# Altium schematic sheet MCUSheet.SchDoc
size 279 x 254 mm
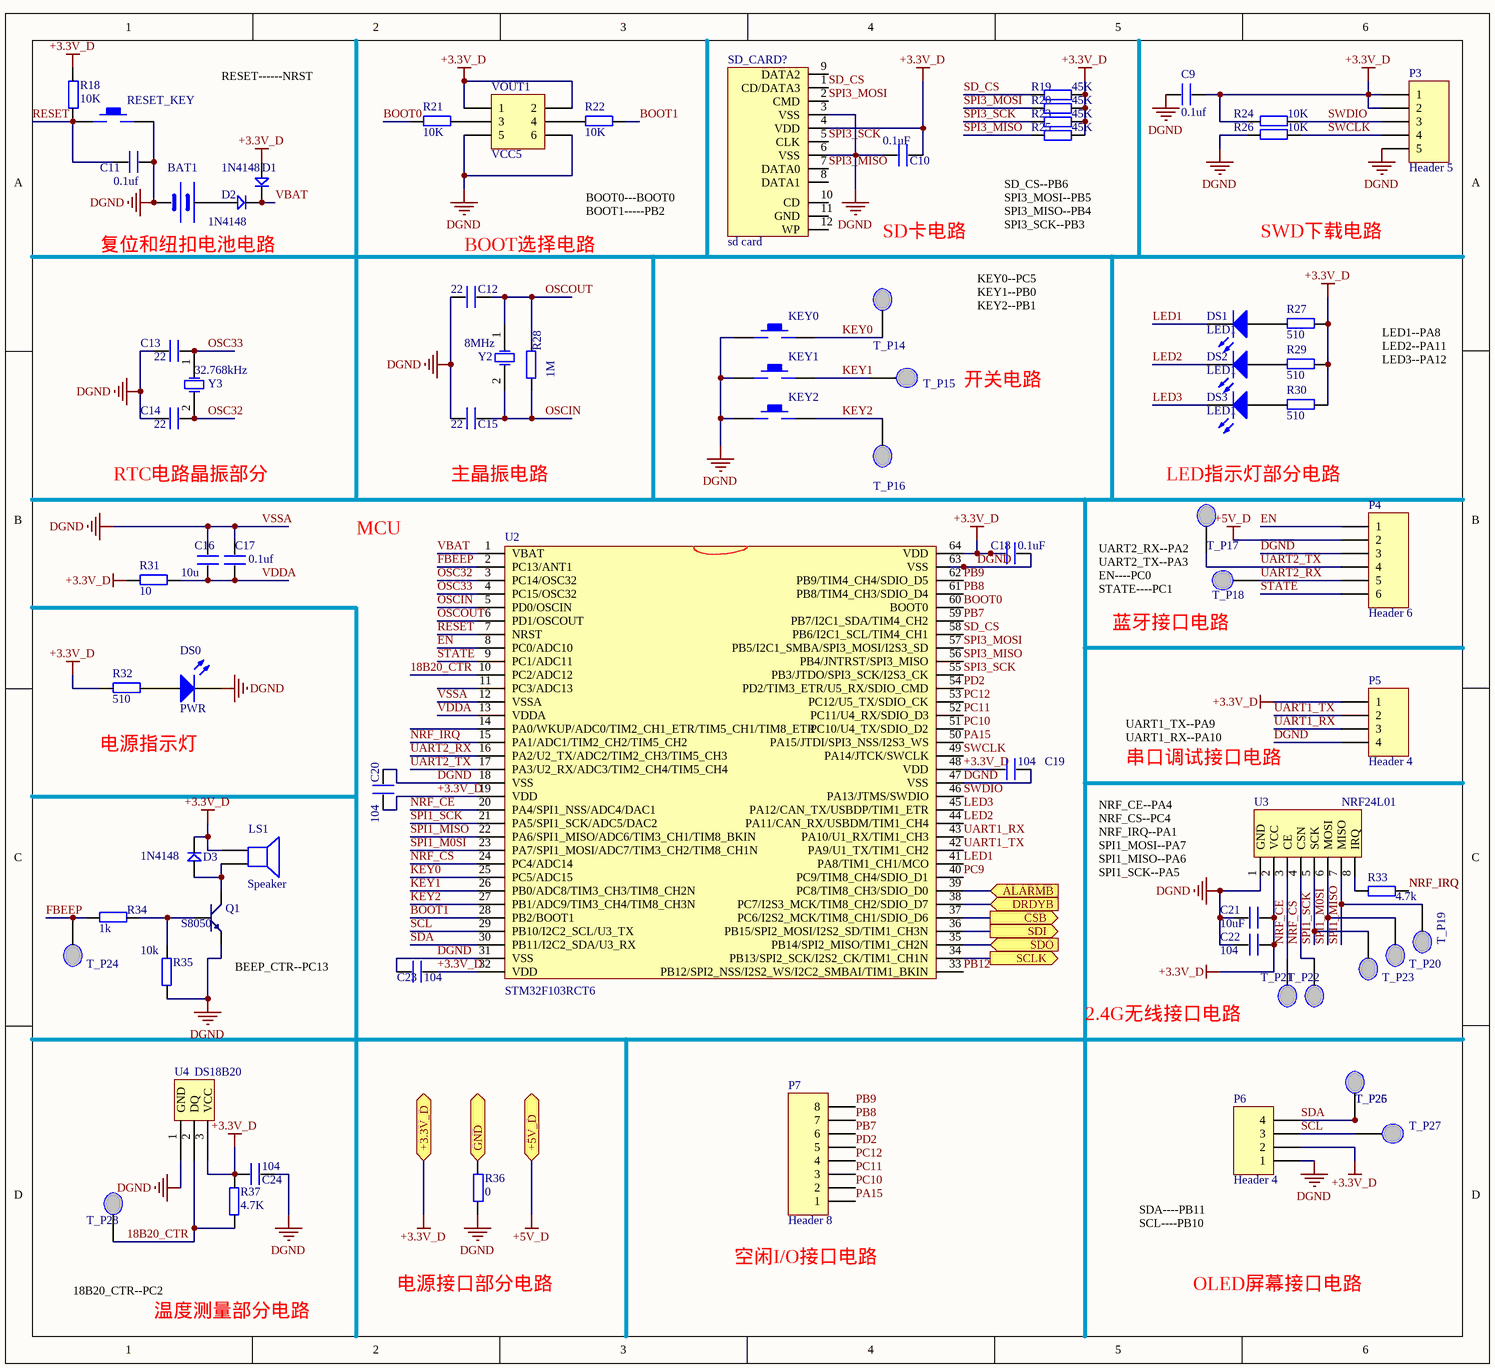
[diagram p0: MCUSheet.SchDoc]

## Parts
BAT1  BATT  [BATM]  (value not drawn)
C9  0.1uf  [0805]
C10  0.1uF  [0805]
C11  0.1uf  [0805]
C12  22  [0805]
C13  22  [0805]
C14  22  [0805]
C15  22  [0805]
C16  10u  [0805]
C17  0.1uf  [0805]
C18  0.1uF  [0805]
C19  104  [0805]
C20  104  [0805]
C21  10uF  [0805]
C22  104  [0805]
C23  104  [0805]
C24  104  [0805]
D1  1N4148  [DIODE_SOP]
D2  1N4148  [DIODE_SOP]
D3  1N4148  [DIODE_SOP]
DS0  PWR  [SMDLED]
DS1  LED1  [SMDLED]
DS2  LED1  [SMDLED]
DS3  LED1  [SMDLED]
KEY0  KEY_M  [KEY_M]  (value not drawn)
KEY1  KEY_M  [KEY_M]  (value not drawn)
KEY2  KEY_M  [KEY_M]  (value not drawn)
LS1  Speaker  [PIN2]
P3  Header 5  [HDR1X5]
P4  Header 6  [HDR1X6]
P5  Header 4  [HDR1X4]
P6  Header 4  [HDR1X4]
P7  Header 8  [HDR1X8]
Q1  S8050  [SOT-23R]
R18  10K  [0805]
R19  45K  [0805]
R20  45K  [0805]
R21  10K  [0805]
R22  10K  [0805]
R23  45K  [0805]
R24  10K  [0805]
R25  45K  [0805]
R26  10K  [0805]
R27  510  [0805]
R28  1M  [0805]
R29  510  [0805]
R30  510  [0805]
R31  10  [0805]
R32  510  [0805]
R33  4.7k  [0805]
R34  1k  [0805]
R35  10k  [0805]
R36  0  [0805]
R37  4.7K  [0805]
RESET_KEY  KEY_M  [KEY_M]  (value not drawn)
SD_CARD?  sd card  [SDCARD_L]
T_P14  Test_Pad  [PCB_Test_Pad]  (value not drawn)
T_P15  Test_Pad  [PCB_Test_Pad]  (value not drawn)
T_P16  Test_Pad  [PCB_Test_Pad]  (value not drawn)
T_P17  Test_Pad  [PCB_Test_Pad]  (value not drawn)
T_P18  Test_Pad  [PCB_Test_Pad]  (value not drawn)
T_P19  Test_Pad  [PCB_Test_Pad]  (value not drawn)
T_P20  Test_Pad  [PCB_Test_Pad]  (value not drawn)
T_P21  Test_Pad  [PCB_Test_Pad]  (value not drawn)
T_P22  Test_Pad  [PCB_Test_Pad]  (value not drawn)
T_P23  Test_Pad  [PCB_Test_Pad]  (value not drawn)
T_P24  Test_Pad  [PCB_Test_Pad]  (value not drawn)
T_P25  Test_Pad  [PCB_Test_Pad]  (value not drawn)
T_P26  Test_Pad  [PCB_Test_Pad]  (value not drawn)
T_P27  Test_Pad  [PCB_Test_Pad]  (value not drawn)
T_P28  Test_Pad  [PCB_Test_Pad]  (value not drawn)
U2  STM32F103RCT6  [LQFP64]
U3  NRF24L01  [NRF24L01]
U4  DS18B20  [DS18B20]
VOUT1  VCC5  [HDR2X3]
Y2  8MHz  [XTAL_US]
Y3  32.768kHz  [XTAL32]

## Ports
+3.3V_D, +5V_D, ALARMB (in), CSB (out), DRDYB (in), GND, SCLK (out), SDI (out), SDO (in)

## Nets
+3.3V_D: C9.1 C10.1 C18.1 C19.1 C20.1 C21.2 C22.2 C23.2 C24.2 D1.1 D3.2 LS1.1 P3.1 P3.2 P5.1 P6.2 R18.2 R19.2 R20.2 R23.2 R24.2 R25.2 R27.1 R29.1 R30.1 R31.2 R32.2 R37.1 SD_CARD?.4(VDD) U2.19(VDD) U2.32(VDD) U2.48(VDD) U2.64(VDD) U3.2(VCC) U4.3(VCC) VOUT1.1 VOUT1.2 ; port +3.3V_D
+5V_D: P4.2 ; port +5V_D
DGND: BAT1.2(GND) C9.2 C10.2 C11.2 C12.1 C13.1 C14.1 C15.1 C16.2 C17.2 C18.2 C19.2 C20.2 C21.1 C22.1 C23.1 C24.1 DS0.2(K) KEY0.1 KEY1.1 KEY2.1 P3.5 P4.3 P5.4 P6.1 Q1.1(E) R26.2 R35.2 R36.1 RESET_KEY.2 SD_CARD?.3(VSS) SD_CARD?.6(VSS) U2.12(VSSA) U2.18(VSS) U2.31(VSS) U2.47(VSS) U2.63(VSS) U3.1(GND) U4.1(GND) VOUT1.5 VOUT1.6  [also labelled VSSA]
18B20_CTR: R37.2 T_P28.1 U2.10(PC2/ADC12) U4.2(DQ)
ALARMB: U2.39(PC8/TIM8_CH3/SDIO_D0) ; port ALARMB
BOOT0: R21.2 U2.60(BOOT0)
BOOT1: R22.1 U2.28(PB2/BOOT1)
CSB: U2.37(PC6/I2S2_MCK/TIM8_CH1/SDIO_D6) ; port CSB
DRDYB: U2.38(PC7/I2S3_MCK/TIM8_CH2/SDIO_D7) ; port DRDYB
EN: P4.1 U2.8(PC0/ADC10)
FBEEP: R34.2 T_P24.1 U2.2(PC13/ANT1)
GND: R36.2 ; port GND
KEY0: KEY0.2 T_P14.1 U2.25(PC5/ADC15)
KEY1: KEY1.2 T_P15.1 U2.26(PB0/ADC8/TIM3_CH3/TIM8_CH2N)
KEY2: KEY2.2 T_P16.1 U2.27(PB1/ADC9/TIM3_CH4/TIM8_CH3N)
LED1: DS1.2(K) U2.41(PA8/TIM1_CH1/MCO)
LED2: DS2.2(K) U2.44(PA11/CAN_RX/USBDM/TIM1_CH4)
LED3: DS3.2(K) U2.45(PA12/CAN_TX/USBDP/TIM1_ETR)
NRF_CE: T_P21.1 U2.20(PA4/SPI1_NSS/ADC4/DAC1) U3.3(CE)
NRF_CS: T_P22.1 U2.24(PC4/ADC14) U3.4(CSN)
NRF_IRQ: R33.2 U2.15(PA1/ADC1/TIM2_CH2/TIM5_CH2)
OSC32: C14.2 U2.3(PC14/OSC32) Y3.2(OSC2)
OSC33: C13.2 U2.4(PC15/OSC32) Y3.1(OSC1)
OSCIN: C15.2 R28.2 U2.5(PD0/OSCIN) Y2.2(OSC2)
OSCOUT: C12.2 R28.1 U2.6(PD1/OSCOUT) Y2.1(OSC1)
PA15: P7.1 U2.50(PA15/JTDI/SPI3_NSS/I2S3_WS)
PB7: P7.6 U2.59(PB7/I2C1_SDA/TIM4_CH2)
PB8: P7.7 U2.61(PB8/TIM4_CH3/SDIO_D4)
PB9: P7.8 U2.62(PB9/TIM4_CH4/SDIO_D5)
PB12: U2.33(PB12/SPI2_NSS/I2S2_WS/I2C2_SMBAI/TIM1_BKIN)
PC9: U2.40(PC9/TIM8_CH4/SDIO_D1)
PC10: P7.2 U2.51(PC10/U4_TX/SDIO_D2)
PC11: P7.3 U2.52(PC11/U4_RX/SDIO_D3)
PC12: P7.4 U2.53(PC12/U5_TX/SDIO_CK)
PD2: P7.5 U2.54(PD2/TIM3_ETR/U5_RX/SDIO_CMD)
RESET: C11.1 R18.1 RESET_KEY.1 U2.7(NRST)
SCL: P6.3 T_P27.1 U2.29(PB10/I2C2_SCL/U3_TX)
SCLK: U2.34(PB13/SPI2_SCK/I2S2_CK/TIM1_CH1N) ; port SCLK
SD_CS: R19.1 SD_CARD?.1(CD/DATA3) U2.58(PB6/I2C1_SCL/TIM4_CH1)
SDA: P6.4 T_P25.1 T_P26.1 U2.30(PB11/I2C2_SDA/U3_RX)
SDI: U2.36(PB15/SPI2_MOSI/I2S2_SD/TIM1_CH3N) ; port SDI
SDO: U2.35(PB14/SPI2_MISO/TIM1_CH2N) ; port SDO
SPI1_M0SI: T_P20.1 U2.23(PA7/SPI1_MOSI/ADC7/TIM3_CH2/TIM8_CH1N) U3.6(MOSI)
SPI1_MISO: T_P19.1 U2.22(PA6/SPI1_MISO/ADC6/TIM3_CH1/TIM8_BKIN) U3.7(MISO)
SPI1_SCK: T_P23.1 U2.21(PA5/SPI1_SCK/ADC5/DAC2) U3.5(SCK)
SPI3_MISO: R25.1 SD_CARD?.7(DATA0) U2.56(PB4/JNTRST/SPI3_MISO)
SPI3_MOSI: R20.1 SD_CARD?.2(CMD) U2.57(PB5/I2C1_SMBA/SPI3_MOSI/I2S3_SD)
SPI3_SCK: R23.1 SD_CARD?.5(CLK) U2.55(PB3/JTDO/SPI3_SCK/I2S3_CK)
STATE: P4.6 U2.9(PC1/ADC11)
SWCLK: P3.4 R26.1 U2.49(PA14/JTCK/SWCLK)
SWDIO: P3.3 R24.1 U2.46(PA13/JTMS/SWDIO)
UART1_RX: P5.3 U2.43(PA10/U1_RX/TIM1_CH3)
UART1_TX: P5.2 U2.42(PA9/U1_TX/TIM1_CH2)
UART2_RX: P4.5 T_P18.1 U2.16(PA2/U2_TX/ADC2/TIM2_CH3/TIM5_CH3)
UART2_TX: P4.4 T_P17.1 U2.17(PA3/U2_RX/ADC3/TIM2_CH4/TIM5_CH4)
VBAT: D1.2 D2.2 U2.1(VBAT)
VDDA: C16.1 C17.1 R31.1 U2.13(VDDA)
NetBAT1_1: BAT1.1(VCC) D2.1
NetD3_1: D3.1 LS1.2 Q1.3(C)
NetDS0_1: DS0.1(A) R32.1
NetDS1_1: DS1.1(A) R27.2
NetDS2_1: DS2.1(A) R29.2
NetDS3_1: DS3.1(A) R30.2
NetQ1_2: Q1.2(B) R34.1 R35.1
NetR21_1: R21.1 VOUT1.3
NetR22_2: R22.2 VOUT1.4
NetR33_1: R33.1 U3.8(IRQ)

Not connected (* = marked no-connect by the designer): SD_CARD? 8(DATA1) 9(DATA2) 10(CD) 11(GND) 12(WP); U2 11(PC3/ADC13) 14(PA0/WKUP/ADC0/TIM2_CH1_ETR/TIM5_CH1/TIM8_ETR)

## Notes on the sheet
- RESET------NRST
- BOOT0---BOOT0
  BOOT1-----PB2
- SD卡电路
- SD_CS--PB6
  SPI3_MOSI--PB5
  SPI3_MISO--PB4
  SPI3_SCK--PB3
- SWD下载电路
- (near BAT1) 复位和纽扣电池电路
- (near C12) BOOT选择电路
- KEY0--PC5
  KEY1--PB0
  KEY2--PB1
- LED1--PA8
  LED2--PA11
  LED3--PA12
- 开关电路
- RTC电路晶振部分
- 主晶振电路
- LED指示灯部分电路
- MCU
- (near T_P17) UART2_RX--PA2
  UART2_TX--PA3
  EN----PC0
  STATE----PC1
- 蓝牙接口电路
- 电源指示灯
- 串口调试接口电路
- UART1_TX--PA9
  UART1_RX--PA10
- NRF_CE--PA4
  NRF_CS--PC4
  NRF_IRQ--PA1
  SPI1_MOSI--PA7
  SPI1_MISO--PA6
  SPI1_SCK--PA5
- (near Q1) BEEP_CTR--PC13
- 2.4G无线接口电路
- SDA----PB11
  SCL----PB10
- 18B20_CTR--PC2
- 温度测量部分电路
- 电源接口部分电路
- (near P7) 空闲I/O接口电路
- OLED屏幕接口电路

## Library data of the parts
BAT1 = BAT
C9-C24 = C
D1-D3 = D
DS0-DS3 = LED2: Typical RED, GREEN, YELLOW, AMBER GaAs LED; Published: 8-Jun-2000; LatestRevisionDate: 17-Jul-2002; LatestRevisionNote: Re-released for DXP Platform.; PackageDocument: Feb-2002; PackageReference: 3.2X1.6X1.1; Publisher: Altium Limited
LS1 = Speaker: Loudspeaker; Published: 24-Mar-1999; LatestRevisionDate: 17-Jul-2002; LatestRevisionNote: Re-released for DXP Platform.; PackageReference: PIN2; Publisher: Altium Limited
P3 = Header 5: Header, 5-Pin; LatestRevisionDate: 17-Jul-2002; LatestRevisionNote: Re-released for DXP Platform.; Publisher: Altium Limited
P4 = Header 6: Header, 6-Pin; LatestRevisionDate: 17-Jul-2002; LatestRevisionNote: Re-released for DXP Platform.; Publisher: Altium Limited
P5 P6 = Header 4: Header, 4-Pin; LatestRevisionDate: 17-Jul-2002; LatestRevisionNote: Re-released for DXP Platform.; Publisher: Altium Limited
P7 = Header 8: Header, 8-Pin; LatestRevisionDate: 17-Jul-2002; LatestRevisionNote: Re-released for DXP Platform.; Publisher: Altium Limited
Q1 = NPN: 8050/BCW846/BCW847
R18-R37 = R
U2 = STM32F103RDT6
VOUT1 = Header 3X2: Header, 3-Pin, Dual row; LatestRevisionDate: 17-Jul-2002; LatestRevisionNote: Re-released for DXP Platform.; Publisher: Altium Limited
Y2 Y3 = XTAL: Crystal Oscillator; Published: 8-Jun-2000; LatestRevisionDate: 17-Jul-2002; LatestRevisionNote: Re-released for DXP Platform.; Publisher: Altium Limited